# EAGLE design AdderRev1 (EAGLE 9.6.2)
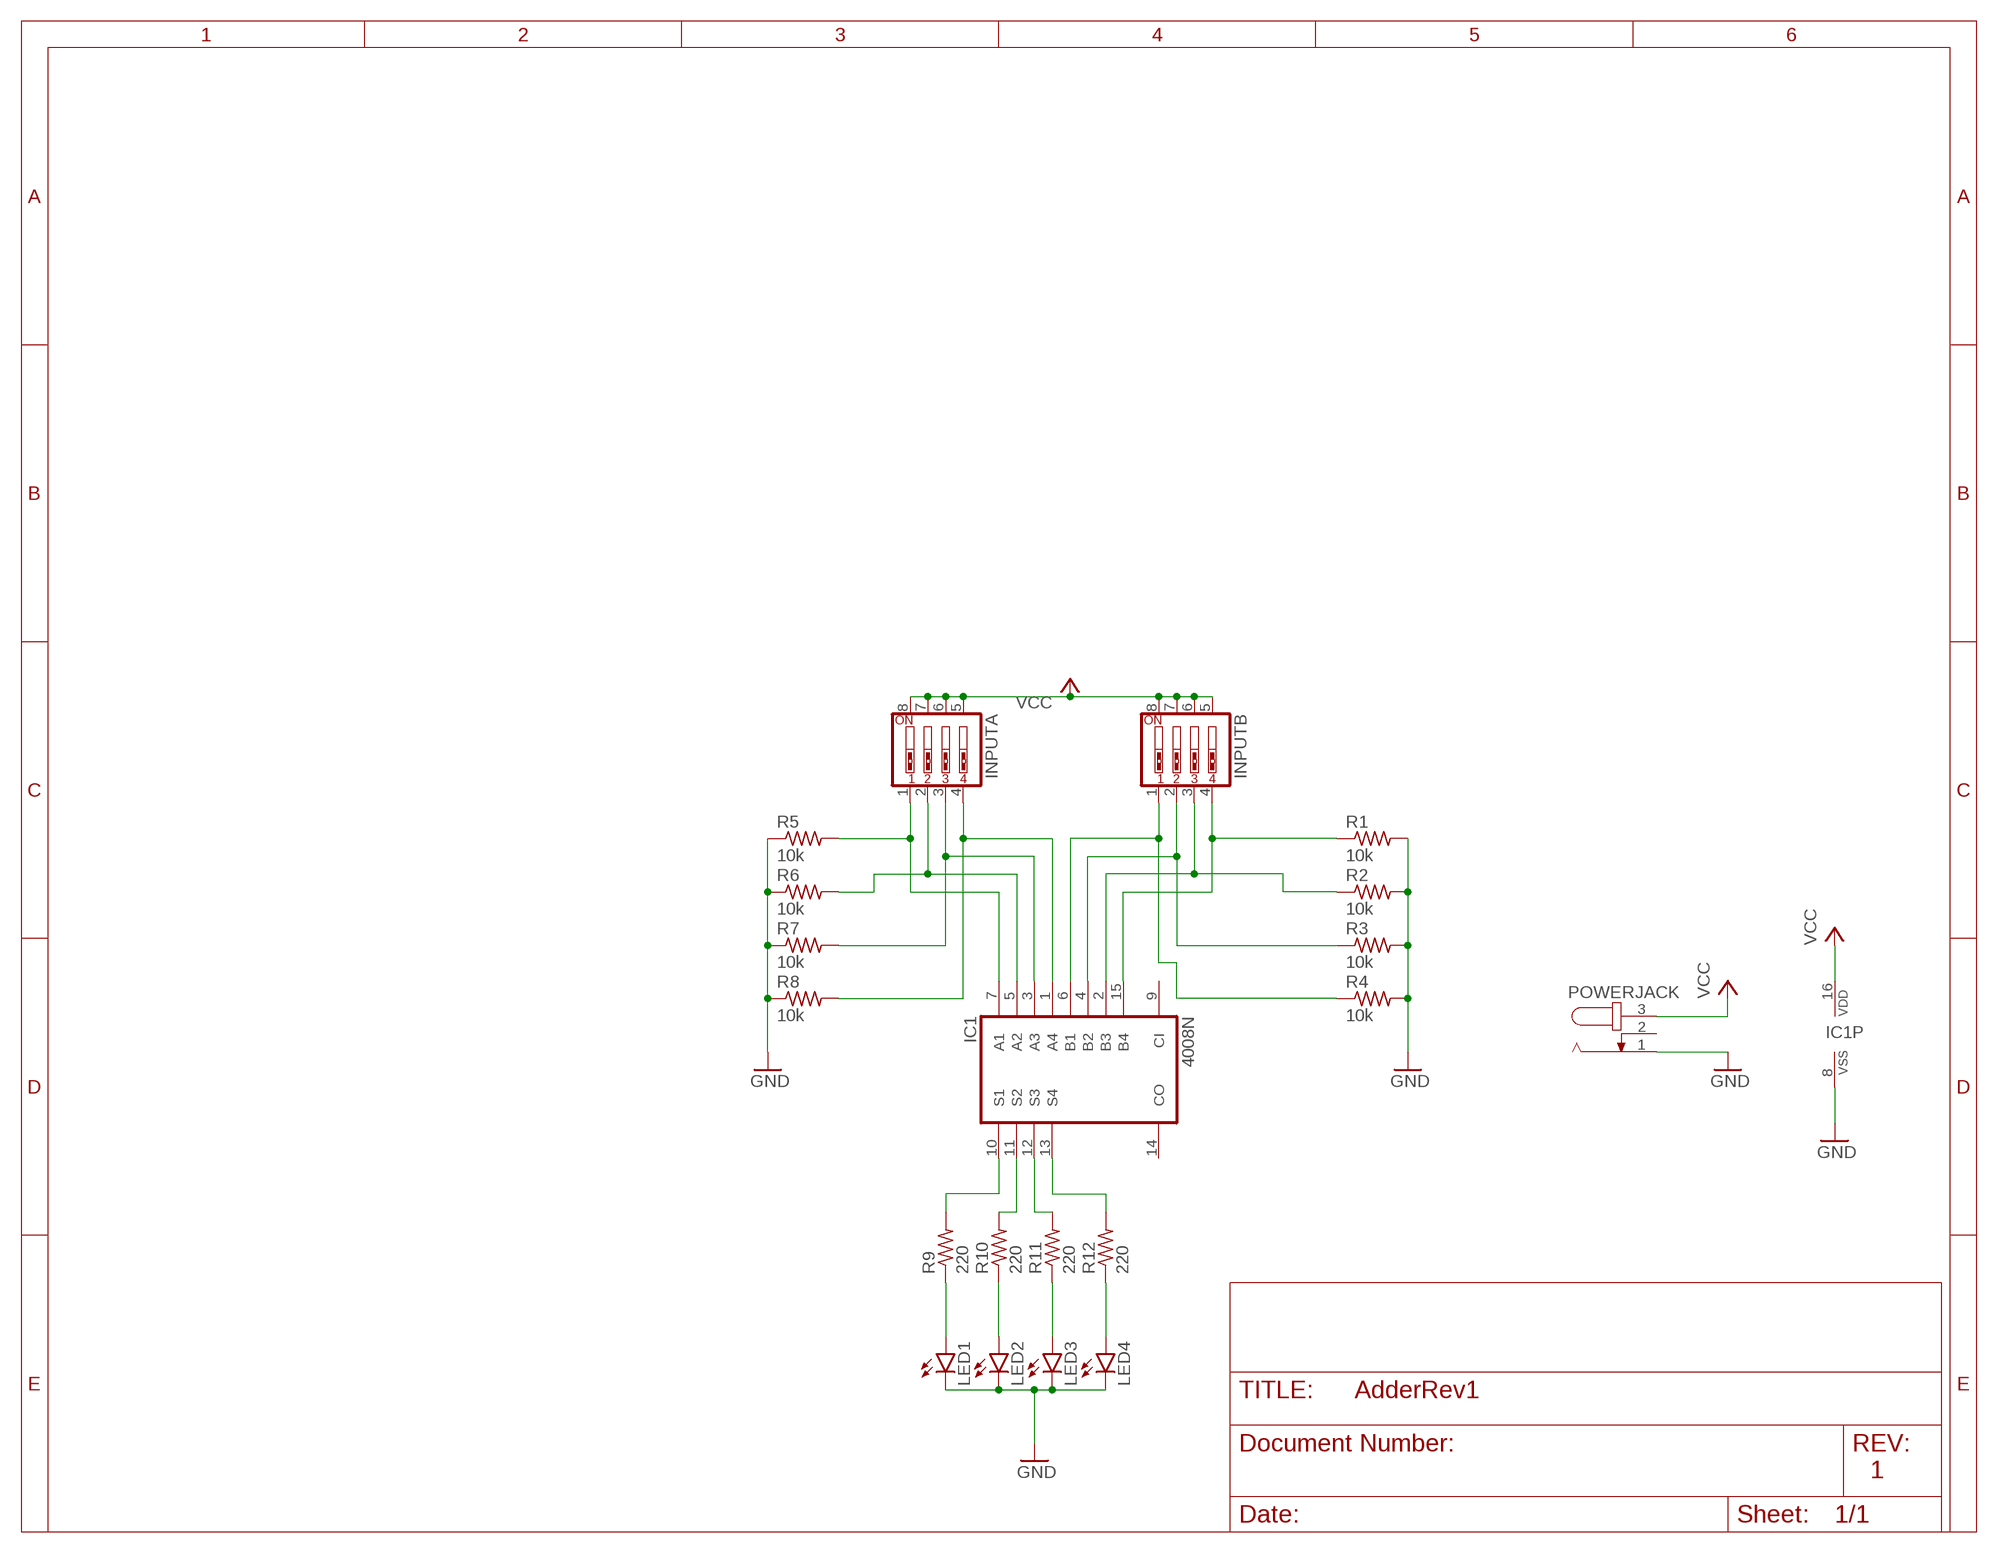
[diagram p0: schematic, sheet 1]

## Parts
IC1  4008N  [DIL16]
INPUTA  SW_DIP-4  [EDG-04]
INPUTB  SW_DIP-4  [EDG-04]
LED1  LED5MM  [LED5MM]
LED2  LED5MM  [LED5MM]
LED3  LED5MM  [LED5MM]
LED4  LED5MM  [LED5MM]
POWERJACK  JACK-PLUG1  [SPC4078]
R1  10k  R-US_0204/7  [0204/7]
R2  10k  R-US_0204/7  [0204/7]
R3  10k  R-US_0204/7  [0204/7]
R4  10k  R-US_0204/7  [0204/7]
R5  10k  R-US_0204/7  [0204/7]
R6  10k  R-US_0204/7  [0204/7]
R7  10k  R-US_0204/7  [0204/7]
R8  10k  R-US_0204/7  [0204/7]
R9  220  R-US_0204/7  [0204/7]
R10  220  R-US_0204/7  [0204/7]
R11  220  R-US_0204/7  [0204/7]
R12  220  R-US_0204/7  [0204/7]

## Nets
GND: IC1.8(VSS) LED1.K(C) LED2.K(C) LED3.K(C) LED4.K(C) POWERJACK.1 R1.2 R2.2 R3.2 R4.2 R5.1 R6.1 R7.1 R8.1
N$1: IC1.7(A1) INPUTA.1 R5.2
N$2: IC1.5(A2) INPUTA.2 R6.2
N$3: IC1.3(A3) INPUTA.3 R7.2
N$4: IC1.1(A4) INPUTA.4 R8.2
N$5: IC1.6(B1) INPUTB.1 R4.1
N$6: IC1.4(B2) INPUTB.2 R3.1
N$7: IC1.2(B3) INPUTB.3 R2.1
N$8: IC1.15(B4) INPUTB.4 R1.1
N$9: IC1.11(S2) R10.2
N$10: IC1.12(S3) R11.2
N$11: IC1.10(S1) R9.2
N$12: IC1.13(S4) R12.2
N$13: LED1.A R9.1
N$14: LED2.A R10.1
N$15: LED3.A R11.1
N$16: LED4.A R12.1
VCC: IC1.16(VDD) INPUTA.5 INPUTA.6 INPUTA.7 INPUTA.8 INPUTB.5 INPUTB.6 INPUTB.7 INPUTB.8 POWERJACK.3
Unconnected: IC1.9(CI) IC1.14(CO) POWERJACK.2

## Notes on the sheet
- 1

## Library data of the parts
IC1 = 40xx:4008: 4-bit full ADDER
INPUTA INPUTB = special:SW_DIP-4: DIP SWITCH
LED1-LED4 = led:LED: LED OSRAM: - CHIPLED LG R971, LG N971, LY N971, LG Q971, LY Q971, LO R971, LY R971 LH N974, LH R974 LS Q976, LO Q976, LY Q976 LO Q996 - Hyper CHIPLED LW Q18S LB Q993, LB Q99A, LB R99A - SideLED LS A670, LO A670, LY A670, LG A670, LP A670 LB A673, LV A673, LT A673, LW A673 LH A674 LY A675 LS A676, LA A676, LO A676, LY A676, LW A676 LS A679, LY A679, LG A679 - Hyper Micro SIDELED® LS Y876, LA Y876, LO Y876, LY Y876 LT Y87S - SmartLED LW L88C, LW L88S LB L89C, LB L89S, LG L890 LS L89K, LO L89K, LY L89K LS L896, LA L896, LO L896, LY L896 - TOPLED LS T670, LO T670, LY T670, LG T670, LP T670 LSG T670, LSP T670, LSY T670, LOP T670, LYG T670 LG T671, LOG T671, LSG T671 LB T673, LV T673, LT T673, LW T673 LH T674 LS T676, LA T676, LO T676, LY T676, LB T676, LH T676, LSB T676, LW T676 LB T67C, LV T67C, LT T67C, LS T67K, LO T67K, LY T67K, LW E67C LS E67B, LA E67B, LO E67B, LY E67B, LB E67C, LV E67C, LT E67C LW T67C LS T679, LY T679, LG T679 LS T770, LO T770, LY T770, LG T770, LP T770 LB T773, LV T773, LT T773, LW T773 LH T774 LS E675, LA E675, LY E675, LS T675 LS T776, LA T776, LO T776, LY T776, LB T776 LHGB T686 LT T68C, LB T68C - Hyper Mini TOPLED® LB M676 - Mini TOPLED Santana® LG M470 LS M47K, LO M47K, LY M47K Source: http://www.osram.convergy.de LUXEON: - LUMILED® LXK2-PW12-R00, LXK2-PW12-S00, LXK2-PW14-U00, LXK2-PW14-V00 LXK2-PM12-R00, LXK2-PM12-S00, LXK2-PM14-U00 LXK2-PE12-Q00, LXK2-PE12-R00, LXK2-PE12-S00, LXK2-PE14-T00, LXK2-PE14-U00 LXK2-PB12-K00, LXK2-PB12-L00, LXK2-PB12-M00, LXK2-PB14-N00, LXK2-PB14-P00, LXK2-PB14-Q00 LXK2-PR12-L00, LXK2-PR12-M00, LXK2-PR14-Q00, LXK2-PR14-R00 LXK2-PD12-Q00, LXK2-PD12-R00, LXK2-PD12-S00 LXK2-PH12-R00, LXK2-PH12-S00 LXK2-PL12-P00, LXK2-PL12-Q00, LXK2-PL12-R00 Source: www.luxeon.com KINGBRIGHT: KA-3528ASYC Source: www.kingbright.com
POWERJACK = con-jack:JACK-PLUG: DC POWER JACK Power Jack, DC, Right Angle, Through Hole, Rated 5A at 16VDC, PC Terminals Distributor: Farnell (www.Farnell.de) Drawing: 84N1161.pdf / 84N1162.pdf Manufacturer: SPC Technology (www.spctechnology.com) Type: SPC4077 / SPC 4078; OC_FARNELL: unknown; OC_NEWARK: unknown
R1-R12 = rcl:R-US_: RESISTOR, American symbol; SPICEPREFIX: R

## Board
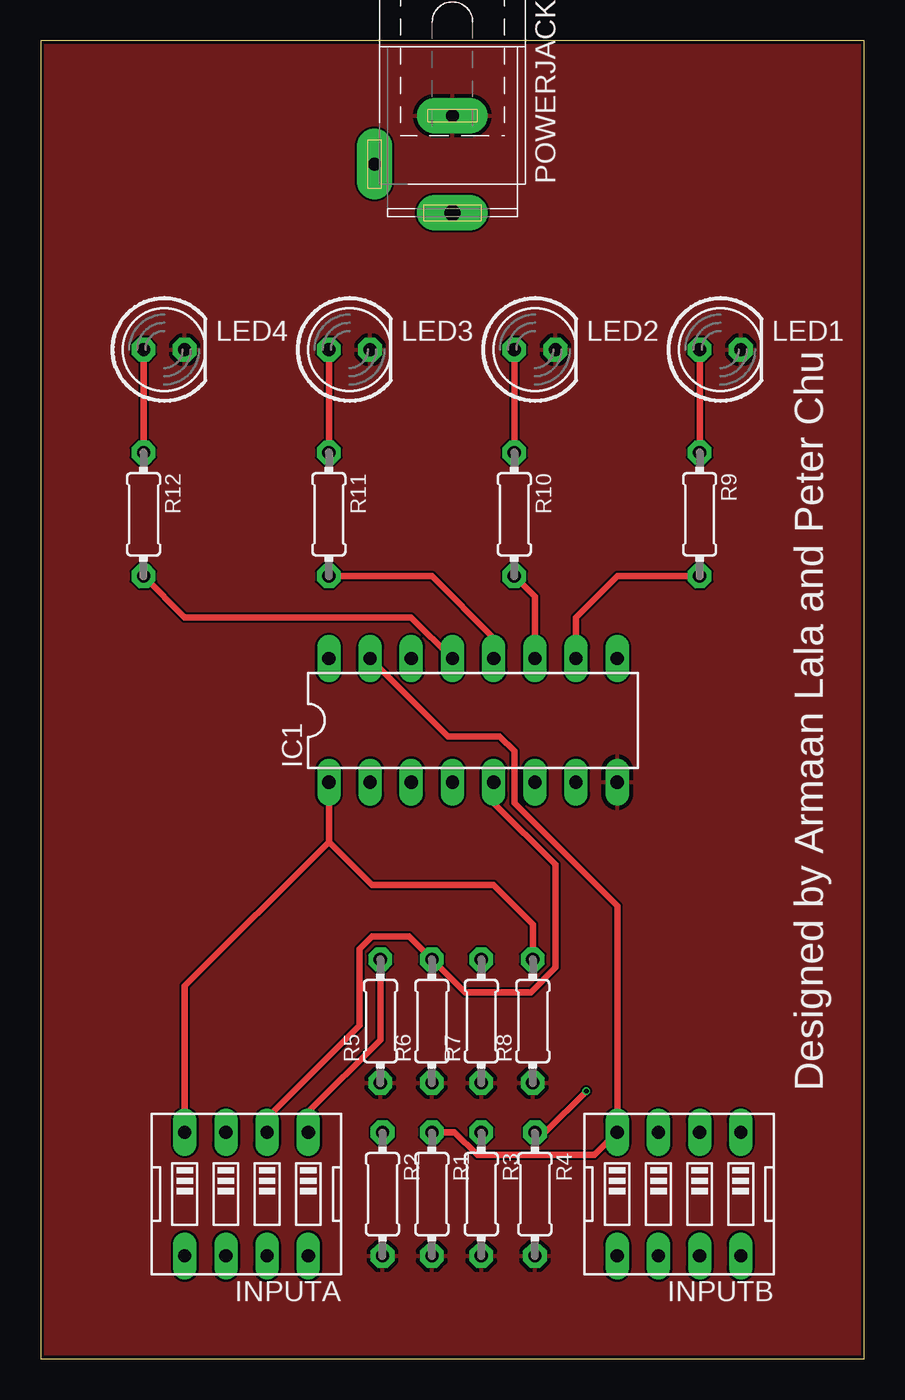
[diagram p1: board, top side]
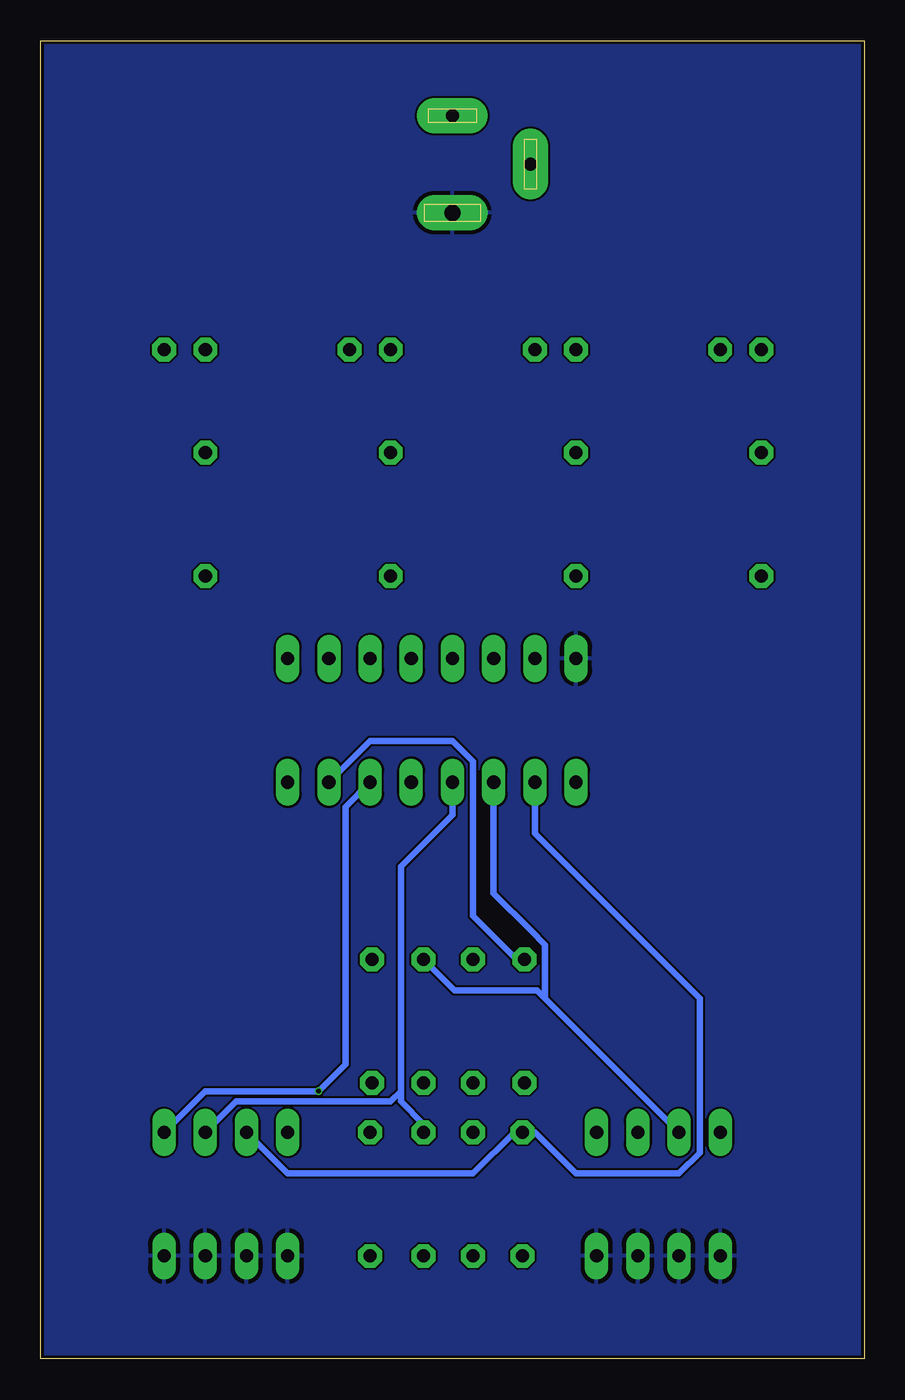
[diagram p2: board, bottom side, seen from below]

Size 50.8 x 81.28 mm. Coordinates in mm from the lower left corner, seen from the top.
Outline: 0,0 50.8,0 50.8,81.28 0,81.28 0,0
Copper layers (1*16): Top 0.035mm / dielectric 1.6mm / Bottom 0.035mm
Design rules "jlcpcb-2layers": minimum track width 5mil, minimum drill 0.3mm, track to track 5mil, track to pad 5mil, pad to pad 5mil, via to via 5mil, smd to smd 5mil, copper to edge 0.2mm, drill to drill 6mil, minimum pad ring 10mil, minimum via ring 3mil, stop-mask expansion 4mil, vias tented up to drill 0mil, thermal gap 10mil

### Footprints (pad centres in the part's own frame; a part is rotated, then mirrored left to right if it is on the bottom)
DIL16 = drill 0.813 long: 1 -8.89,-3.81; 2 -6.35,-3.81; 3 -3.81,-3.81; 4 -1.27,-3.81; 5 1.27,-3.81; 6 3.81,-3.81; 7 6.35,-3.81; 8 8.89,-3.81; 9 8.89,3.81; 10 6.35,3.81; 11 3.81,3.81; 12 1.27,3.81; 13 -1.27,3.81; 14 -3.81,3.81; 15 -6.35,3.81; 16 -8.89,3.81
EDG-04 = drill 0.813 long: 1 -3.81,-3.81; 2 -1.27,-3.81; 3 1.27,-3.81; 4 3.81,-3.81; 5 3.81,3.81; 6 1.27,3.81; 7 -1.27,3.81; 8 -3.81,3.81
LED5MM = drill 0.813 octagon: A -1.27,0; K 1.27,0
SPC4078 = drill 0.8 pad 2.184 long: 1 -3,0; 2 0,-4.8 | drill 1 pad 2.184 long: 3 3,0
0204/7 = drill 0.813 octagon: 1 -3.81,0; 2 3.81,0

### Placement (x,y rotation side)
IC1  26.67,39.37 0 top
INPUTA  12.7,10.16 180 top
INPUTB  39.37,10.16 180 top
LED1  41.91,62.23 0 top
LED2  30.48,62.23 0 top
LED3  19.05,62.23 0 top
LED4  7.62,62.23 0 top
POWERJACK  25.4,73.66 270 top
R1  24.13,10.16 270 top
R2  21.08,10.16 270 top
R3  27.18,10.16 270 top
R4  30.48,10.16 270 top
R5  20.95,20.83 90 top
R6  24.13,20.83 90 top
R7  27.18,20.83 90 top
R8  30.35,20.83 90 top
R9  40.64,52.07 270 top
R10  29.21,52.07 270 top
R11  17.78,52.07 270 top
R12  6.35,52.07 270 top

### Tracks (layer width: path | path; a pad name or v marks a point on that pad's centre or on a via)
GND
  pour Top: 17.78,87.63 -6.35,87.63 -7.62,86.36 -7.62,-3.81 55.88,-3.81 59.69,0 59.69,87.63
N$1
  Top 0.406: INPUTA.1 16.51,15.24 20.95,19.68 R5.2
  Bottom 0.406: IC1.7 30.48,38.1 25.4,38.1 24.13,36.83 24.13,27.3 21.59,24.77 20.95,24.77 R5.2
N$2
  Top 0.406: INPUTA.2 13.97,14.86 19.68,20.57 19.68,25.27 20.45,26.04 22.73,26.04 R6.2 26.16,22.61 30.23,22.61 31.75,24.13 31.75,30.48 27.94,34.29 IC1.5
N$3
  Bottom 0.406: 19.68,22.23 20.19,22.73 25.27,22.73 R7.2 | INPUTA.3 19.05,21.59 19.68,22.23 | IC1.3 22.86,29.21 22.86,28.7 20.57,26.42 19.68,25.53 19.68,22.23
N$4
  Top 0.406: 17.78,31.88 20.45,29.21 27.94,29.21 30.35,26.8 R8.2 | IC1.1 17.78,31.88 | 17.78,31.88 8.89,22.99 INPUTA.4
N$5  (via drill 0.3)
  Top 0.406: v33.66,16.51 31.11,13.97 R4.1
  Bottom 0.406: INPUTB.1 40.64,16.51 v33.66,16.51 32,18.16 32,34.04 IC1.6
N$6
  Bottom 0.406: INPUTB.2 38.73,15.88 29.21,15.88 28.57,16.51 | IC1.4 25.4,33.53 28.57,30.35 28.57,16.51 | 28.57,16.51 28.57,15.88 27.18,14.48 R3.1
N$7
  Bottom 0.406: INPUTB.3 35.56,11.43 24.13,11.43 21.59,13.97 R2.1 20.32,13.97 17.78,11.43 11.43,11.43 10.16,12.7 10.16,22.23 20.32,32.38 IC1.2
N$8
  Top 0.406: IC1.15 25.12,38.38 28.31,38.38 29.21,37.48 29.21,34.29 35.56,27.94 INPUTB.4 35.55,13.97 34.15,12.57 26.94,12.57 25.54,13.97 R1.1
N$9
  Top 0.406: R10.2 30.48,46.99 IC1.11
N$10
  Top 0.406: R11.2 24.13,48.26 27.94,44.45 IC1.12
N$11
  Top 0.406: IC1.10 33.02,45.72 35.56,48.26 R9.2
N$12
  Top 0.406: R12.2 8.89,45.72 22.86,45.72 IC1.13
N$13
  Top 0.406: LED1.A R9.1
N$14
  Top 0.406: LED2.A R10.1
N$15
  Top 0.406: LED3.A R11.1
N$16
  Top 0.406: LED4.A R12.1
VCC
  pour Bottom: 25.4,87.63 -6.35,87.63 -10.16,83.82 -10.16,-3.81 -8.89,-5.08 59.69,-5.08 59.69,86.36 58.42,87.63

### Text on the board
tPlace: Designed by Armaan Lala and Peter Chu